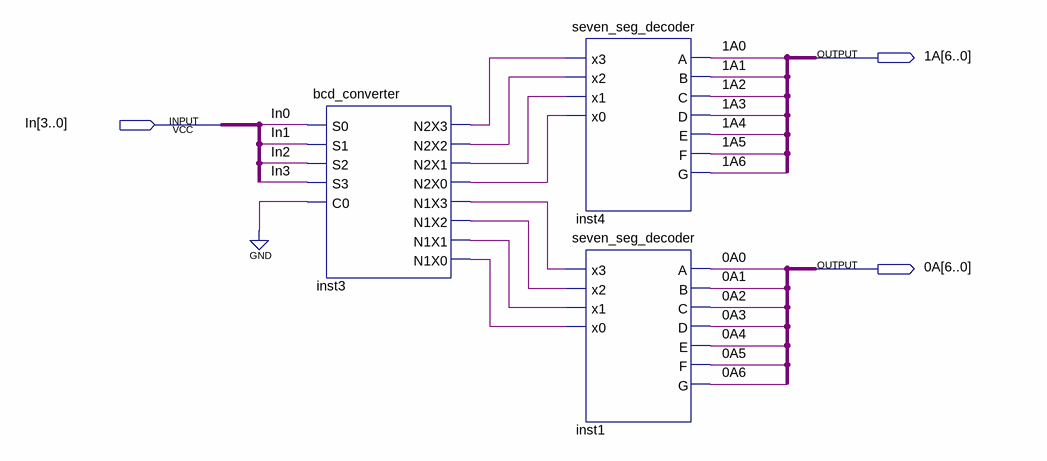
[diagram p0: schematic sheet]
// Quartus schematic bcdANDssd.bdf as structural Verilog: 3 symbols, 3 pins
module bcdANDssd (
  input  [3:0] In,
  output [6:0] \1A ,
  output [6:0] \0A 
);

  wire inst3_n1x0, inst3_n1x1, inst3_n1x2, inst3_n1x3, inst3_n2x0, inst3_n2x1, inst3_n2x2, inst3_n2x3;

  bcd_converter inst3 (
    .S0(In[0]), .S1(In[1]), .S2(In[2]), .S3(In[3]), .C0(1'b0), .N2X3(inst3_n2x3), .N2X2(inst3_n2x2),
    .N2X1(inst3_n2x1), .N2X0(inst3_n2x0), .N1X3(inst3_n1x3), .N1X2(inst3_n1x2), .N1X1(inst3_n1x1),
    .N1X0(inst3_n1x0));
  seven_seg_decoder inst4 (
    .x3(inst3_n2x3), .x2(inst3_n2x2), .x1(inst3_n2x1), .x0(inst3_n2x0), .A(\1A [0]), .B(\1A [1]),
    .C(\1A [2]), .D(\1A [3]), .E(\1A [4]), .F(\1A [5]), .G(\1A [6]));
  seven_seg_decoder inst1 (
    .x3(inst3_n1x3), .x2(inst3_n1x2), .x1(inst3_n1x1), .x0(inst3_n1x0), .A(\0A [0]), .B(\0A [1]),
    .C(\0A [2]), .D(\0A [3]), .E(\0A [4]), .F(\0A [5]), .G(\0A [6]));
endmodule
